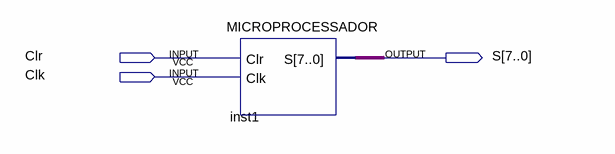
[diagram p0: schematic sheet]
// Quartus schematic teste.bdf as structural Verilog: 1 symbols, 3 pins
module teste (
  input  Clr,
  input  Clk,
  output [7:0] S
);

  MICROPROCESSADOR inst1 (.Clr(Clr), .Clk(Clk), .S(S));
endmodule
